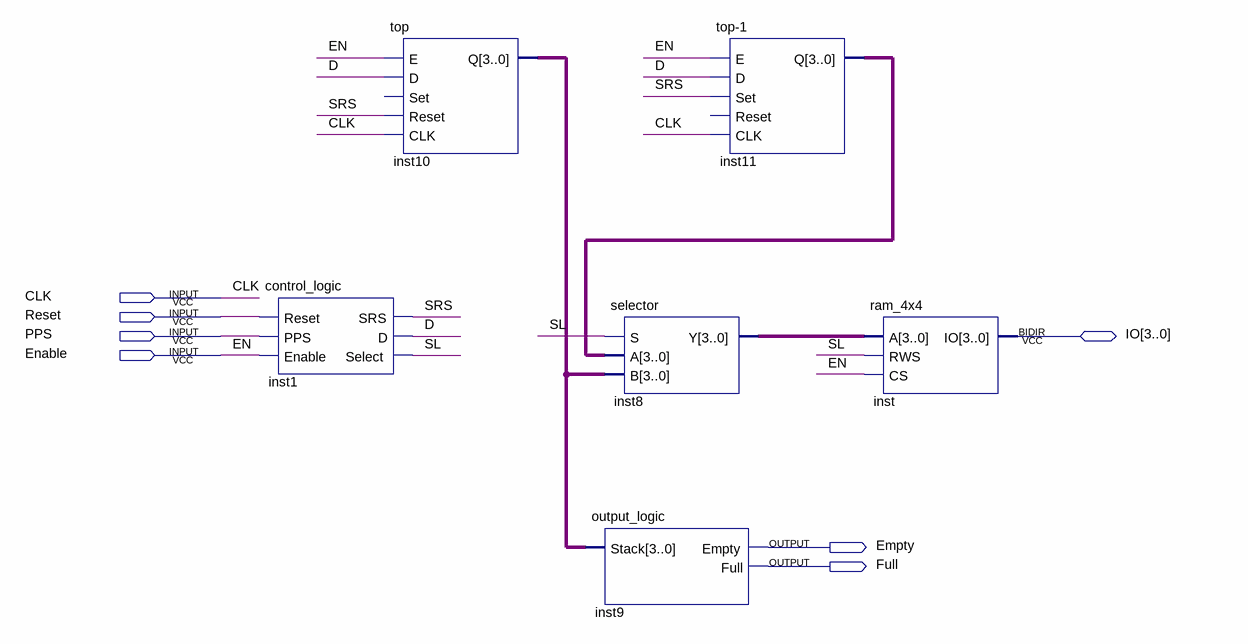
[diagram p0: schematic sheet]
// Quartus schematic stack4x4.bdf as structural Verilog: 6 symbols, 7 pins
module stack4x4 (
  input  CLK,
  input  Reset,
  input  PPS,
  input  Enable,
  inout  [3:0] IO,
  output Empty,
  output Full
);

  wire D, SL, SRS;
  wire [3:0] inst8_y, inst10_q, inst11_q;

  control_logic inst1 (.Reset(Reset), .PPS(PPS), .Enable(Enable), .SRS(SRS), .D(D), .Select(SL));
  top inst10 (.E(Enable), .D(D), .Reset(SRS), .CLK(CLK), .Q(inst10_q));  // open: Set
  selector inst8 (.S(SL), .A(inst11_q), .B(inst10_q), .Y(inst8_y));
  output_logic inst9 (.Stack(inst10_q), .Empty(Empty), .Full(Full));
  \top-1  inst11 (.E(Enable), .D(D), .Set(SRS), .CLK(CLK), .Q(inst11_q));  // open: Reset
  ram_4x4 inst (.A(inst8_y), .RWS(SL), .CS(Enable), .IO(IO));

  // Other names for the same wires on the sheet: EN = Enable
endmodule
